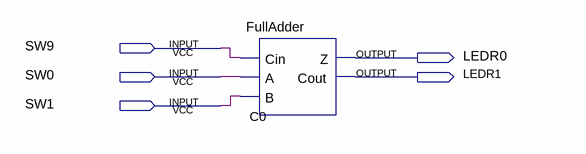
[diagram p0: schematic sheet]
// Quartus schematic Testbench.bdf as structural Verilog: 1 symbols, 5 pins
module Testbench (
  input  SW9,
  input  SW0,
  input  SW1,
  output LEDR0,
  output LEDR1
);

  FullAdder C0 (.Cin(SW9), .A(SW0), .B(SW1), .Z(LEDR0), .Cout(LEDR1));
endmodule
